# EAGLE design relay_isolator_1A (EAGLE 7.5.0)
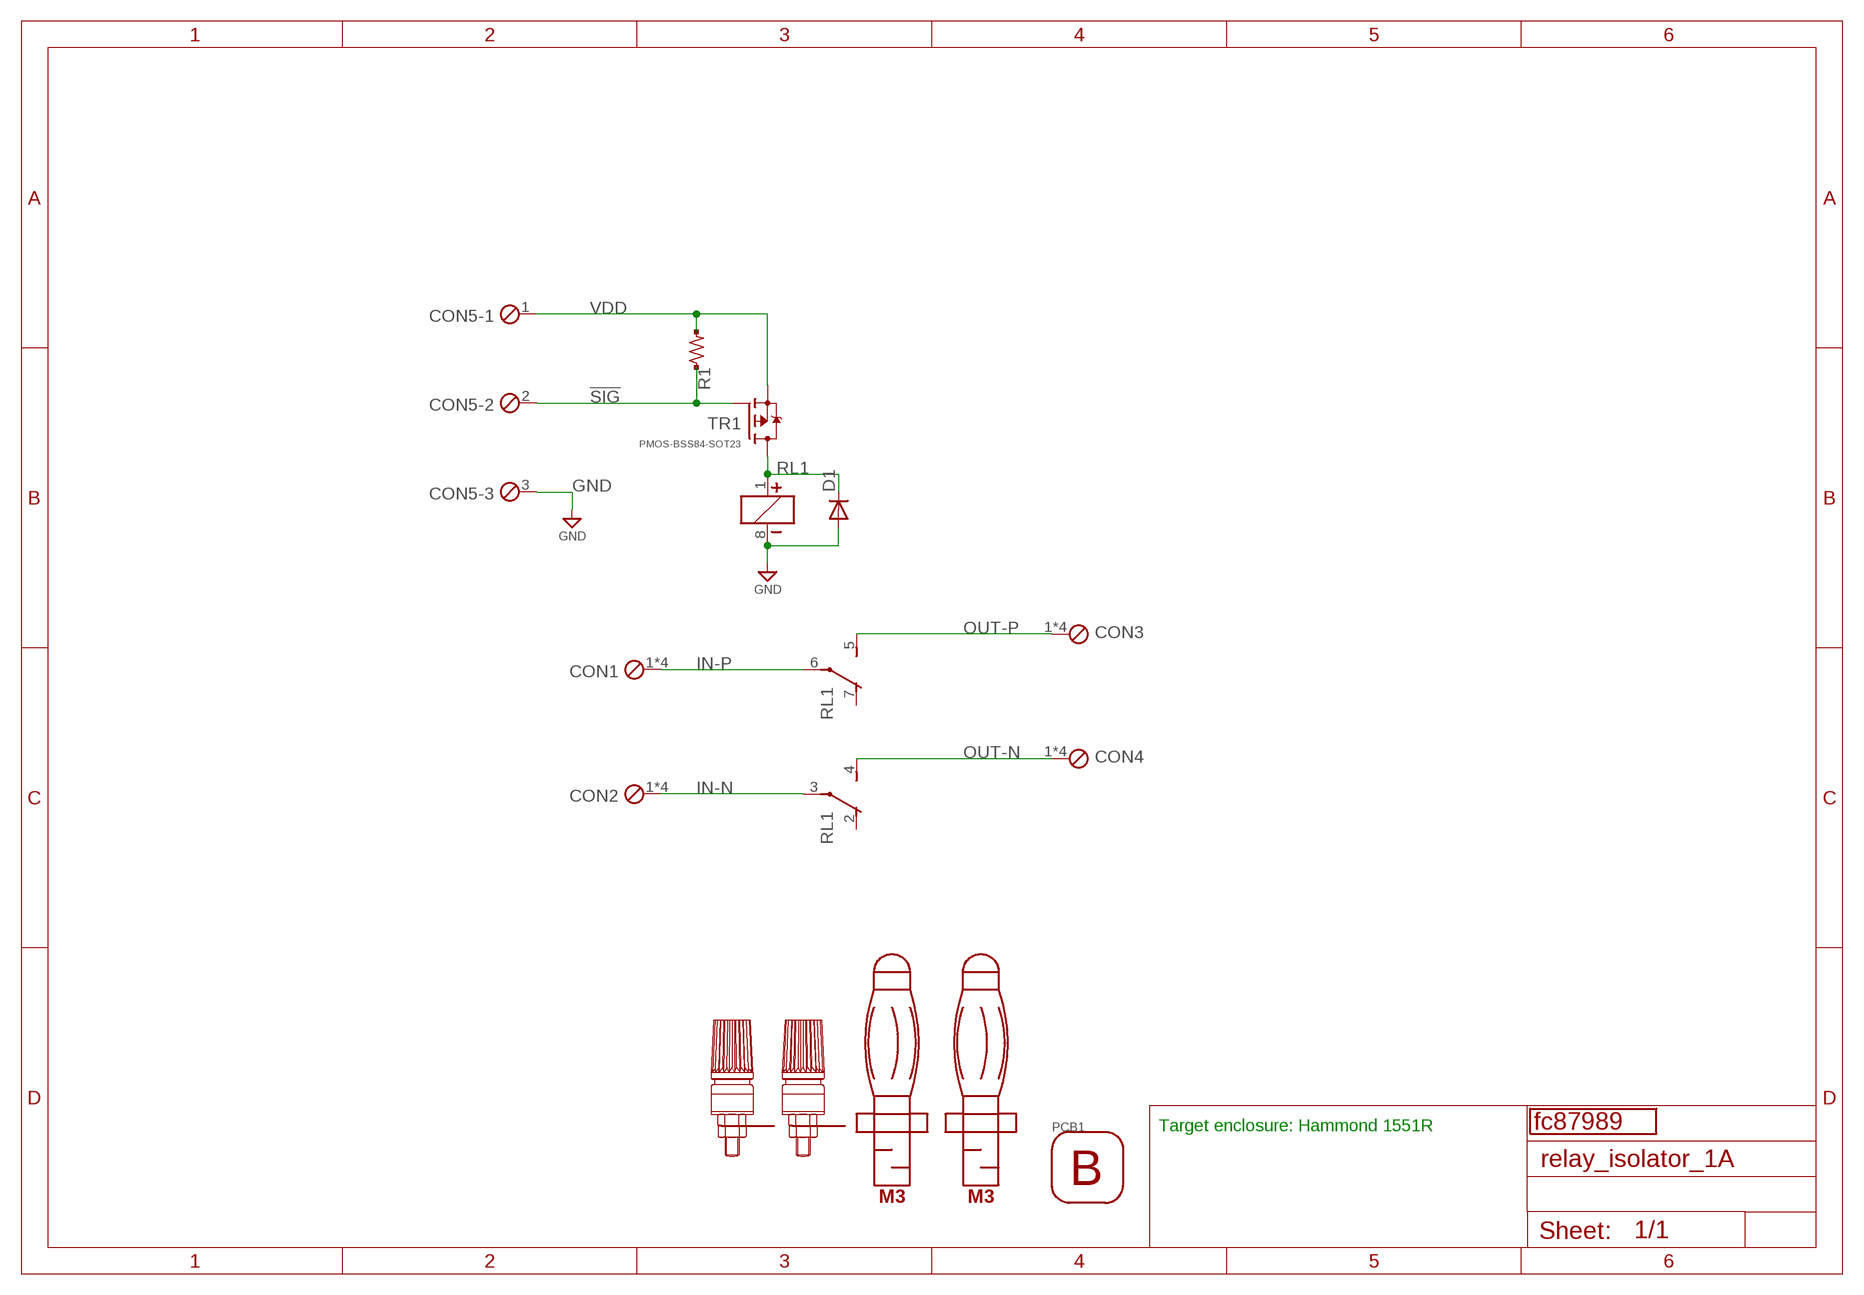
[diagram p0: schematic, sheet 1]

## Parts
CON1  KEYSTONE-7790  [KEYSTONE7790]
CON2  KEYSTONE-7790  [KEYSTONE7790]
CON3  KEYSTONE-7792  [KEYSTONE7790]
CON4  KEYSTONE-7792  [KEYSTONE7790]
CON5  ETB43034B  [ETB43034]
D1  DIODE2-100V0.3A-SOD123  [DIODE-2125]
GIT1  fc87989  GIT-REVISION_1.7  [GIT-REVISION_1.7]
PCB1  HAMMOND-PCB-BK-1551R  [HAMMOND-1551R]
R1  R-US-10K-1608  [R-1608-PADPAD]
REF1  POMONA72918  [POMONA72918]
REF2  POMONA72918  [POMONA72918]
REF3  T-6530  [T-6530]
REF4  T-6530  [T-6530]
RL1  RELAY-2C-POL-5V-G6K-2P  [G6K-2P]
TR1  PMOS-BSS84-SOT23  [SOT95P300X140-3N]

## Nets
!SIG!: CON5.2 R1.1 TR1.1(G)
GND: CON5.3 D1.A RL1.8
IN-N: CON2.1 CON2.2 CON2.3 CON2.4 RL1.3(COM)
IN-P: CON1.1 CON1.2 CON1.3 CON1.4 RL1.6(COM)
N$5: D1.K(C) RL1.1 TR1.3(D)
OUT-N: CON4.1 CON4.2 CON4.3 CON4.4 RL1.4(NO)
OUT-P: CON3.1 CON3.2 CON3.3 CON3.4 RL1.5(NO)
VDD: CON5.1 R1.2 TR1.2(S)
Unconnected: RL1.2(NC) RL1.7(NC)

## Notes on the sheet
- Target enclosure: Hammond 1551R

## Library data of the parts
CON1 CON2 = mylib:KEYSTONE-*; DIGIKEY: 36-7790-ND; MOUSER: 534-7790
CON3 CON4 = mylib:KEYSTONE-*; DIGIKEY: 36-7792-ND; MOUSER: 534-7792
CON5 = mylib:ETB43034*; AKIZUKI: P-11590
D1 = mylib:DIODE2-*: DIODE high speed (Philips); AKIZUKI: I-07084; DIGIKEY: 1N4148W-FDICT-ND
GIT1 = git-revision:GIT-REVISION; NOT_COMPONENT: YES
PCB1 = mylib:HAMMOND-PCB-*; DIGIKEY: HM913-ND
R1 = mylib:R-US-*: SMD resistor Packages : -1608 : 1.6 x 0.8 mm -2125 : 2.0 x 1.25 mm -3216 : 3.2 x 1.6 mm
REF1 REF2 = mylib:POMONA72918; DIGIKEY: 501-1200-ND
REF3 REF4 = mylib:T-6530
RL1 = mylib:RELAY-2C-POL-*; DIGIKEY: Z116-ND; MOUSER: 653-G6K-2P-DC5
TR1 = mylib:PMOS-*; AKIZUKI: I-04269/I-04270(reel); DIGIKEY: BSS84CT-ND

## Board
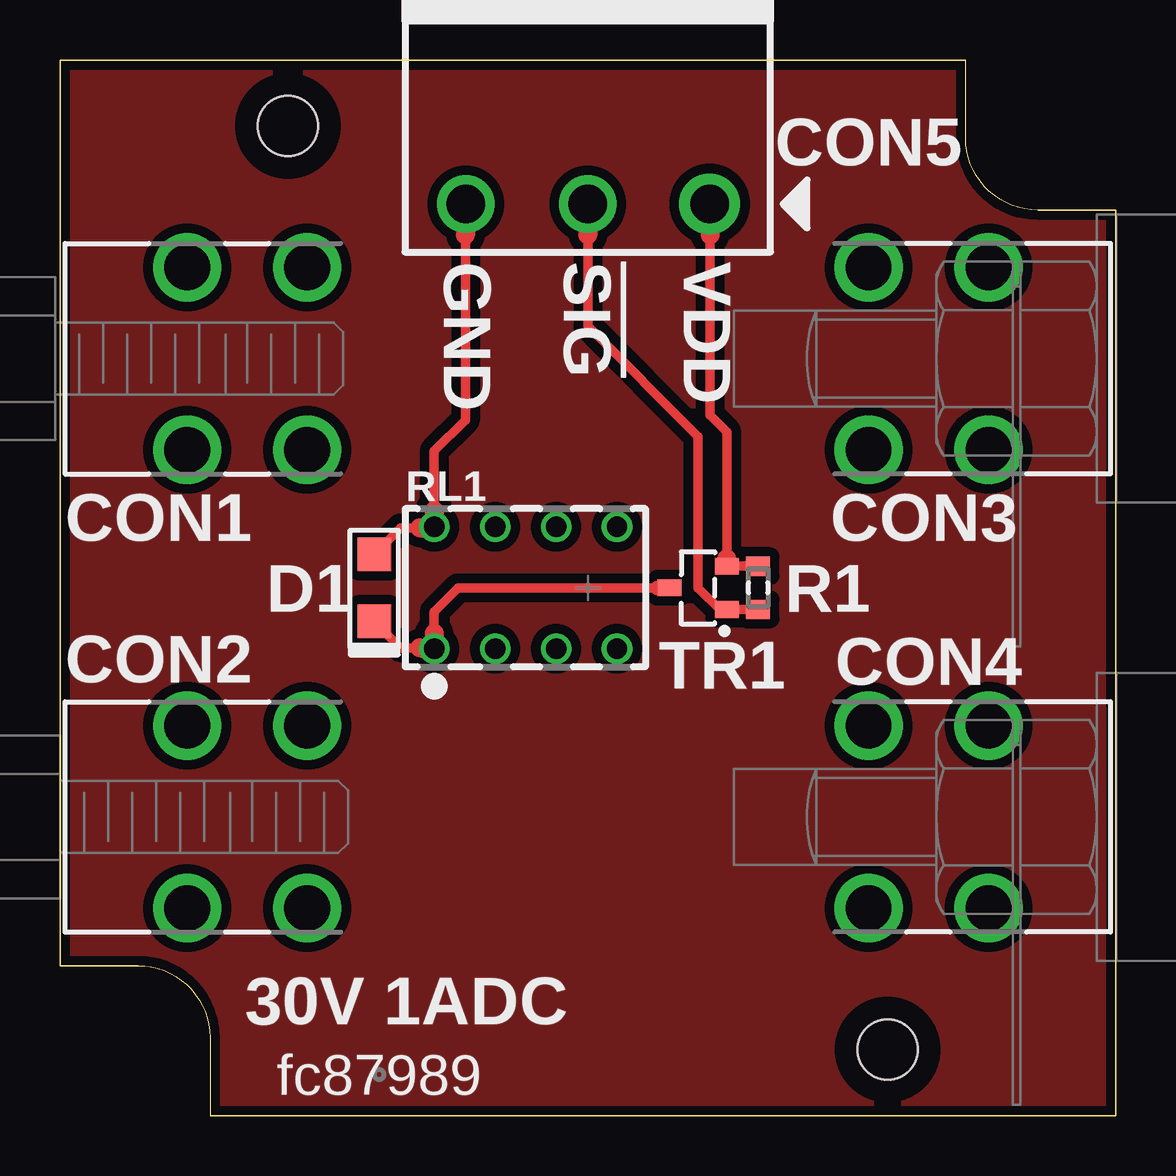
[diagram p1: board, top side]
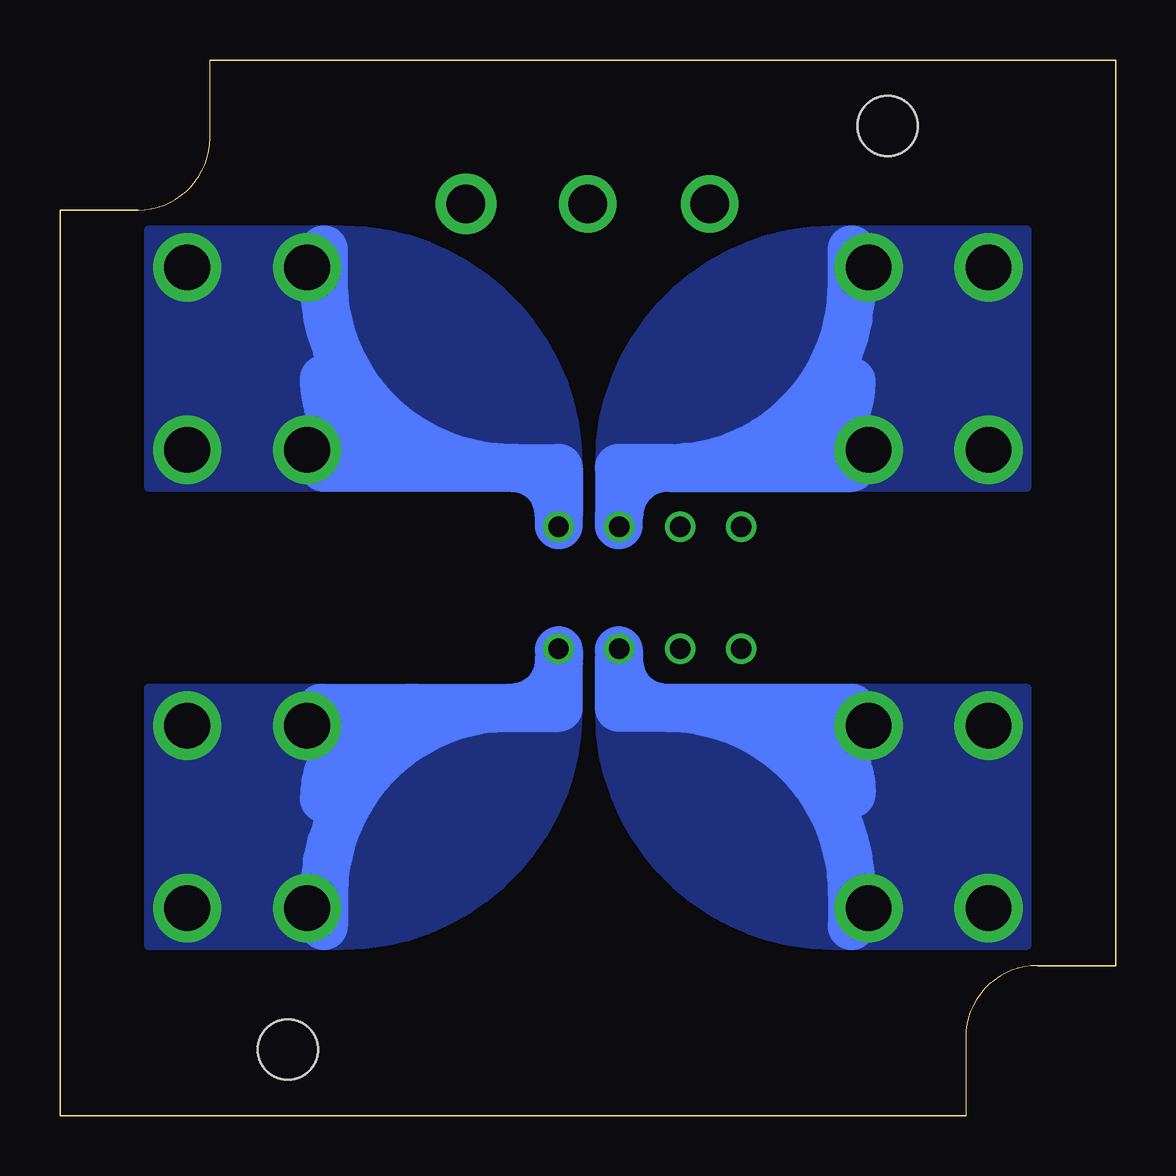
[diagram p2: board, bottom side, seen from below]

Size 44 x 44 mm. Coordinates in mm from the lower left corner, seen from the top.
Outline: 6.25,0 44,0 44,37.75 40.75,37.75 arc-90 37.75,40.75 37.75,44 0,44 0,6.25 3.25,6.25 arc-90 6.25,3.25 6.25,0
Copper layers (1*16): Top 0.035mm / dielectric 1.5mm / Bottom 0.035mm
Design rules "default": minimum track width 0.15mm, minimum drill 0.3mm, track to track 0.15mm, track to pad 0.15mm, pad to pad 0.15mm, via to via 0.15mm, smd to smd 0mil, copper to edge 0.4mm, drill to drill 8mil, minimum pad ring 0.15mm, minimum via ring 0.15mm, stop-mask expansion 4mil, vias tented up to drill 100mil, thermal gap 10mil
tRestrict: 1 lines

### Footprints (pad centres in the part's own frame; a part is rotated, then mirrored left to right if it is on the bottom)
KEYSTONE7790 = drill 1.9: 1 5.1,3.8; 2 10.1,3.8; 3 5.1,-3.8; 4 10.1,-3.8
ETB43034 = drill 1.6 pad 2.54: 1 -5.08,0 | drill 1.6: 2 0,0; 3 5.08,0
DIODE-2125 = smd 1.4 x 1.4: A 1.4,0; K -1.4,0
HAMMOND-1551R = hole 2.5: 9.5,41.25; 34.5,2.75
R-1608-PADPAD = smd 0.8 x 1: 1 -0.9,0; 2 0.9,0
G6K-2P = drill 0.85: 1 0,-2.54; 2 2.54,-2.54; 3 5.08,-2.54; 4 7.62,-2.54; 5 7.62,2.54; 6 5.08,2.54; 7 2.54,2.54; 8 0,2.54
SOT95P300X140-3N = smd 0.7 x 1: 1 -0.9,-1.2; 2 0.9,-1.2; 3 0,1.2

### Placement (x,y rotation side)
CON1  0.2,31.55 0 top
CON2  0.2,12.45 0 top
CON3  43.8,31.55 180 top
CON4  43.8,12.45 180 top
CON5  22,38 180 top
D1  13.1,22 90 top
GIT1  13.3,1.7 0 top
PCB1  0,0 0 top
R1  29.1,22 90 top
REF1  -0.2,31.55 90 top
REF2  0,12.45 90 top
REF3  44,12.45 270 top
REF4  44,31.55 270 top
RL1  15.6,22 0 top
TR1  26.6,22 90 top

### Tracks (layer width: path | path; a pad name or v marks a point on that pad's centre or on a via)
!SIG!
  Top 0.4: 22,36.7 22,32.9 26.6,28.3 26.6,22 27.5,21.1 TR1.1 R1.1
  Top 0.8: CON5.2 22,36.7
GND
  Top 0.4: D1.A 14.2,24.5 15,24.5 | 15.56,24.5 RL1.8 | 16.9,36.7 16.9,29 15.6,27.7 15.6,25.2
  Top 0.8: 15,24.5 15.56,24.5 | CON5.3 17,38 17,37.9 16.9,37.9 16.9,36.7 | 15.6,25.2 RL1.8
IN-N
  Bottom 0.8: RL1.3 20.68,19.42 20.7,19.4
  Bottom 2: 20.7,19.4 20.7,19 | 11,17 14.6,17 | 14.6,17 18.7,17 | 18.7,17 arc90 11,9.3 11,7.9 | 14.6,17 arc90 11,13.4 | 20.7,19 arc-90 18.7,17 | 18.7,17 20.7,17 20.7,19
  pour Bottom (isolate 0.4, no thermals): 3.7,17.8 3.7,7.1 11.8,7.1 11.8,17.8
  pour Bottom (isolate 0.4, no thermals): 11.8,7.1 11.8,17.8 21.5,17.8 21.5,16.8 arc-90
IN-P
  Bottom 0.8: RL1.6 20.7,24.34 20.7,24.6
  Bottom 2: 18.6,27 arc-90 20.7,25 | 20.7,24.6 20.7,25 | 18.6,27 14.6,27 | 14.6,27 11,27 | 18.6,27 arc-90 11,34.6 11,36.1 | 14.6,27 arc-90 11,30.6 | 18.6,27 20.7,27 20.7,25
  pour Bottom (isolate 0.4, no thermals): 3.7,36.9 3.7,26.2 11.8,26.2 11.8,36.9
  pour Bottom (isolate 0.4, no thermals): 11.8,36.9 11.8,26.2 21.5,26.2 21.5,27.2 arc90
N$2
  pour Top (isolate 0.4, no thermals): 0,44 0,0 44,0 44,44
N$5
  Top 0.4: D1.K 14.2,19.5 15,19.5 | 15.56,19.5 RL1.1 | 24.9,22 16.6,22 15.6,21 15.6,20.1
  Top 0.6: TR1.3 24.9,22
  Top 0.8: 15,19.5 15.56,19.5 | 15.6,20.1 RL1.1
OUT-N
  Bottom 0.8: RL1.4 23.22,19.42 23.2,19.4
  Bottom 2: 23.2,19.4 23.2,19 | 23.2,19 arc90 25.2,17 | 33.1,17 29.2,17 | 29.2,17 25.2,17 | 25.2,17 arc-90 33,9.2 33,7.9 | 29.2,17 arc-90 33,13.2 | 25.2,17 23.2,17 23.2,19
  pour Bottom (isolate 0.4, no thermals): 32.2,17.8 32.2,7.1 40.3,7.1 40.3,17.8
  pour Bottom (isolate 0.4, no thermals): 32.2,7.1 32.2,17.8 22.4,17.8 22.4,16.9 arc90
OUT-P
  Bottom 0.8: RL1.5 23.22,24.8 23.2,24.6
  Bottom 2: 23.2,24.6 23.2,25 | 23.2,25 arc-90 25.2,27 | 25.2,27 29.3,27 | 29.3,27 33,27 | 25.2,27 arc90 33,34.8 33,36.1 | 29.3,27 arc90 33,30.7 | 25.2,27 23.2,27 23.2,25
  pour Bottom (isolate 0.4, no thermals): 32.2,36.9 32.2,26.2 40.3,26.2 40.3,36.9
  pour Bottom (isolate 0.4, no thermals): 32.2,36.9 arc90 22.4,27.1 22.4,26.2 32.2,26.2
VDD
  Top 0.4: CON5.1 27.08,37.92 27.1,37.9 | TR1.2 R1.2 | 27.1,36.7 27.1,29.2 27.8,28.5 27.8,23.2
  Top 0.6: TR1.2 27.8,23
  Top 0.8: 27.1,37.9 27.1,36.7 | 27.8,23 27.8,23.2

### Text on the board
tPlace: GND | !SIG! | VDD | 30V 1ADC